# EAGLE design TOSA_Board_5 (EAGLE 9.2.0)
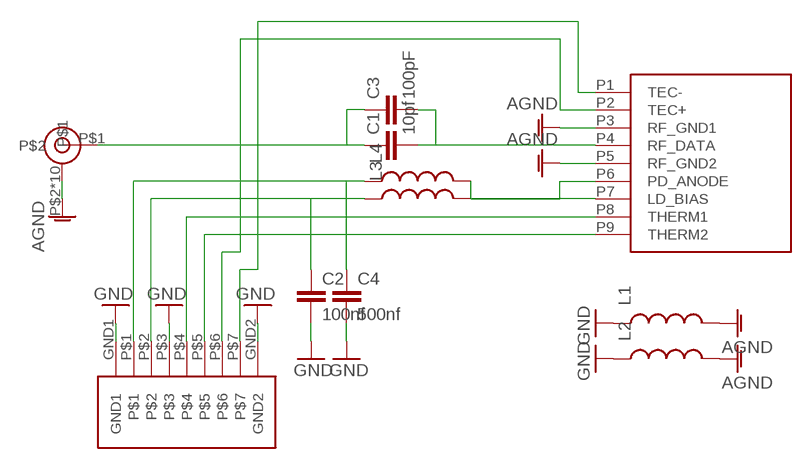
[diagram p0: schematic, sheet 1]

## Parts
C1  10pf  C-EUC0603K  [C0603K]
C2  100nf  C-EUC0603K  [C0603K]
C3  100pF  C-EUC0603K  [C0603K]
C4  500nf  C-EUC0603K  [C0603K]
L1  INDUCTOR30OHM,1.8A  [0603]
L2  INDUCTOR30OHM,1.8A  [0603]
L3  INDUCTOR30OHM,1.8A  [0603]
L4  INDUCTOR30OHM,1.8A  [0603]
U$2  TOSA  [MSA-9]
U$3  EDGE_MOUNT_MMCXMCX  [EDGE_MOUNT_MCX]
U$4  SAMTEC_T1M_X7  [SAMTEX_T1M_X7]

## Nets
AGND: L1.2 L2.2 U$2.P3(RF_GND1) U$2.P5(RF_GND2) U$3.P$2 U$3.P$3 U$3.P$4 U$3.P$5 U$3.P$6 U$3.P$7 U$3.P$8 U$3.P$9 U$3.P$10 U$3.P$11
GND: C2.2 C4.2 L1.1 L2.1 U$4.GND1 U$4.GND2 U$4.P$3
LD_BIAS: C4.1 L4.1 U$4.P$1
N$1: C1.1 C3.1 U$3.P$1
N$3: C1.2 C3.2 U$2.P4(RF_DATA)
N$6: L3.2 U$2.P6(PD_ANODE)
N$8: L4.2 U$2.P7(LD_BIAS)
PD_ANODE: C2.1 L3.1 U$4.P$2
TEC+: U$2.P2(TEC+) U$4.P$6
TEC-: U$2.P1(TEC-) U$4.P$7
THERM1: U$2.P8(THERM1) U$4.P$4
THERM2: U$2.P9(THERM2) U$4.P$5

## Library data of the parts
C1-C4 = rcl:C-EU: CAPACITOR, European symbol
L1-L4 = SparkFun-Passives:INDUCTOR: Inductors Basic Inductor/Choke - 0603 and 1206. Footprints are not proven and vary greatly between part numbers. SRN6045- 33uH, 20% 1.4A SDR0403-560KL - 56uH, 10%, 500mA RMS/740mA peak; PROD_ID: RES-07859
U$2 = custom:TOSA
U$3 = custom:EDGE_MOUNT_MMCX
U$4 = custom:SAMTEC_T1M_X7

## Board
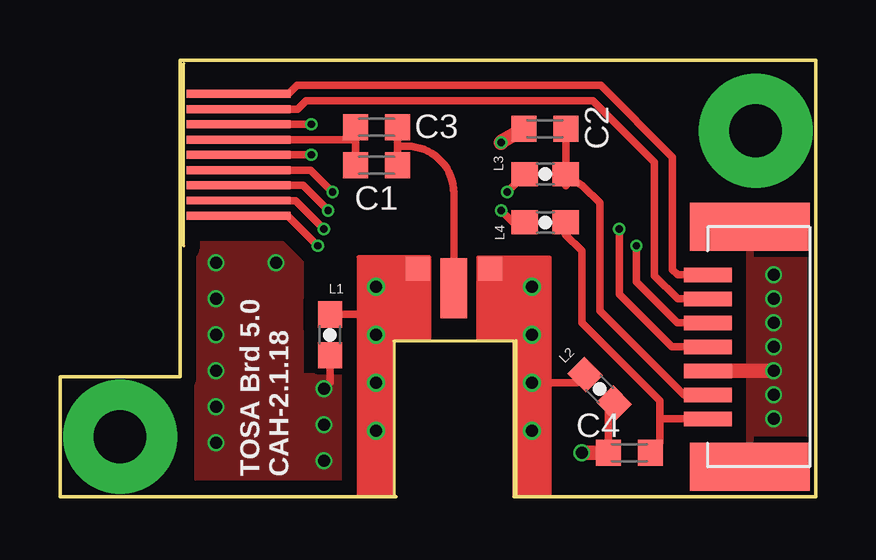
[diagram p1: board, top side]
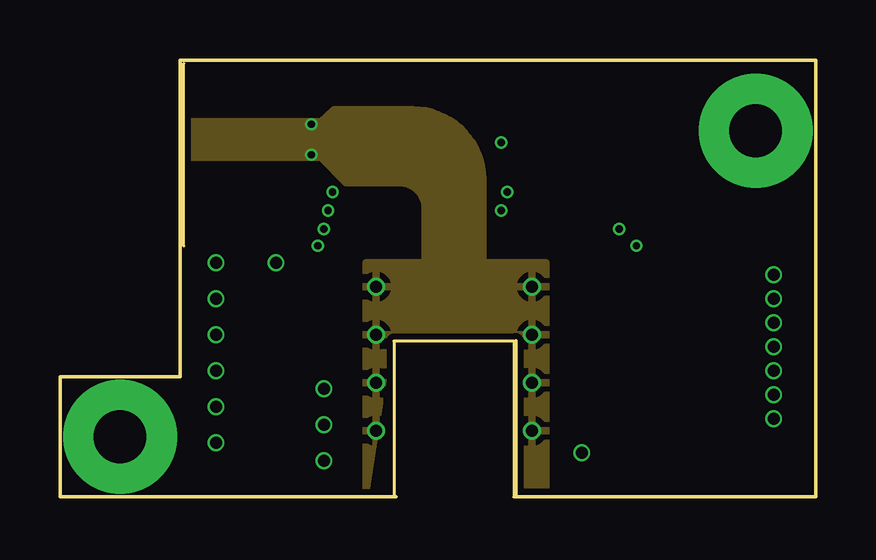
[diagram p2: board, inner layer Route2]
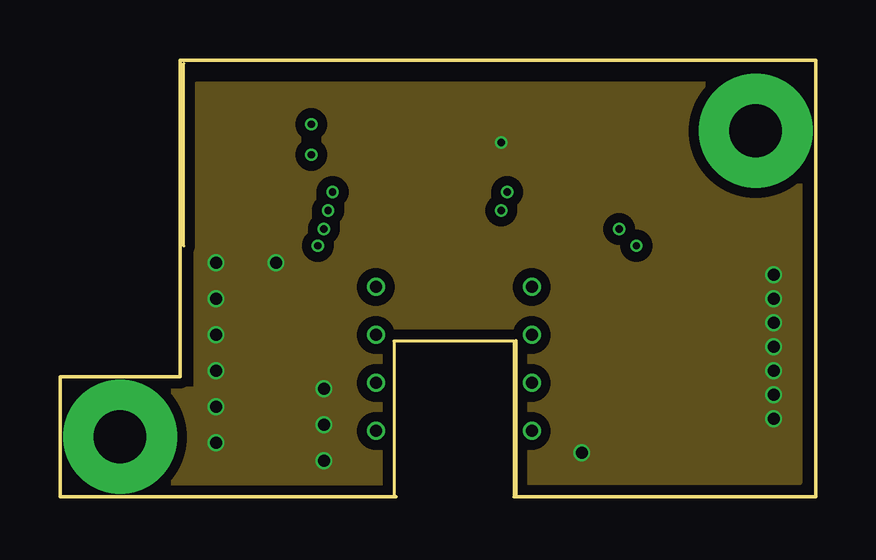
[diagram p3: board, inner layer Route15]
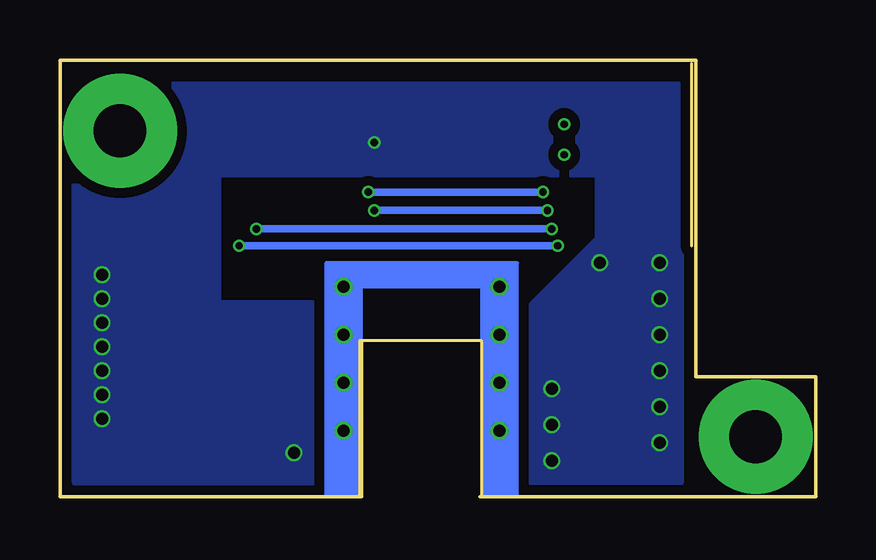
[diagram p4: board, bottom side, seen from below]

Size 31.5 x 18.2 mm. Coordinates in mm from the lower left corner, seen from the top.
Outline: 19.86,0 31.43,0
Outline: 0,0 13.24,0
Outline: 0,0 0,5 5,5 5,18.2 31.5,18.2 31.5,0 19,0 19,6.5
Outline: 0,0 14,0
Copper layers (1*2*15*16): Top 0.035559375mm / dielectric 0.17018125mm / Route2 0.01778125mm / dielectric 47mil / Route15 0.01778125mm / dielectric 0.17018125mm / Bottom 0.035559375mm
Design rules "8217": minimum track width 5mil, minimum drill 0.2mm, track to track 6mil, track to pad 6mil, pad to pad 6mil, via to via 6mil, smd to smd 0mil, copper to edge 10mil, drill to drill 12mil, minimum pad ring 4mil, minimum via ring 4mil, stop-mask expansion 2mil, vias tented up to drill 25mil, thermal gap 10mil

### Footprints (pad centres in the part's own frame; a part is rotated, then mirrored left to right if it is on the bottom)
C0603K = smd 1.05 x 1.08: 1 -0.875,0; 2 0.875,0
0603 = smd 1.1 x 1: 1 -0.85,0; 2 0.85,0
MSA-9 = smd 4.318 x 0.33: P1 0.254,-2.54; P2 0.254,-1.905; P3 0.254,-1.27; P4 0.254,-0.635; P5 0.254,0; P6 0.254,0.635; P7 0.254,1.27; P8 0.254,1.905; P9 0.254,2.54
EDGE_MOUNT_MCX = smd 2.5 x 1.1: P$1 2.2,0 | drill 0.5 pad 0.75: P$2 -3.75,3.25; P$3 -1.75,3.25; P$4 0.25,3.25; P$5 2.25,3.25; P$6 -3.75,-3.25; P$7 -1.75,-3.25; P$8 0.25,-3.25; P$9 2.25,-3.25 | smd 1 x 1: P$10 3,1.5; P$11 3,-1.5
SAMTEX_T1M_X7 = smd 2 x 5: GND1 5,1.75; GND2 -5,1.75 | smd 0.6 x 2: P$1 3,0; P$2 2,0; P$3 1,0; P$4 0,0; P$5 -1,0; P$6 -2,0; P$7 -3,0

### Placement (x,y rotation side)
C1  13.2,13.81 180 top
C2  20.22,15.33 180 top
C3  2pF  [C0603K]  13.2,15.4 180 top
C4  23.74,1.84 180 top
L1  11.25,6.75 90 top
L2  22.5,4.5 135 top
L3  20.23,13.45 180 top
L4  20.23,11.43 180 top
U$2  7.7,14.25 180 top
U$3  16.42,6.5 90 top
U$4  27,6.25 270 top

### Tracks (layer width: path | path; a pad name or v marks a point on that pad's centre or on a via)
AGND  (via drill 0.3 pad 0.51)
  Top 0.305: U$2.P3 v10.48,15.52 | U$2.P5 v10.48,14.25 | U$3.P$7 21.55,4.75 L2.2 | U$3.P$11 18.92,9.5 U$3.P$9 | U$3.P$10 13.92,9.5 U$3.P$5 | L1.2 12.65,7.6 12.75,7.5 12.75,7.17 U$3.P$4
  pour Route2: 5.4,15.62 5.4,14.15 10.89,14.15 11.93,13.09 14.27,13.09 arc-90 15.22,11.88 15.22,9.75 12.75,9.75 12.75,0.25 13.75,6.75 19,6.75 19,0.25 20.25,0.25 20.25,9.75 17.62,9.75 17.62,13.22 arc90 14.72,16.12 11.43,16.12 10.89,15.62
GND  (via drill 0.3 pad 0.51, 0.5)
  Top 0.305: C4.2 22.86,3.66 L2.1 | L1.1 11.25,4.75 v11,4.5
  Top 0.61: C4.2 v21.75,1.84 | U$4.P$3 v29.75,5.25 | C2.2 18.46,14.83 v18.39,14.76
  other vias: 29.75,9.25 29.75,8.25 29.75,7.25 29.75,6.25 29.75,4.25 29.75,3.25 9,9.75 11,3 11,1.5 6.5,6.75 6.5,8.25 6.5,9.75 6.5,5.25 6.5,3.75 6.5,2.25
  pour Route15 (isolate 0.406): 5.71,17.14 30.8,17.14 30.8,0.64 0.64,0.64 0.64,4.45 5.71,4.45
  pour Top: 26.5,12 31,12 31,0.5 26.5,0.5 26.5,2 28.75,2 28.75,10.5 26.5,10.5
  pour Top (isolate 0.61): 5.75,0.5 12.5,0.5 12.5,5 10,5 10,9.75 9.25,10.5 5.75,10.5
  pour Bottom (isolate 0.406): 30.8,17.1 5.7,17.1 5.7,0.6 11.75,0.6 11.75,8 9,10.75 9,13.5 25,13.5 25,8 21,8 21,0.6 30.8,0.6
LD_BIAS
  Top 0.305: L4.1 21.08,10.92 21.75,10.25 21.75,7.25 25,4 25,3.25 | 25,3.25 U$4.P$1 | C4.1 24.59,1.84 25,2.25 25,3.25
N$1
  Top 0.305: C3.1 14.07,14.61 | 14.07,14.61 14.47,14.61 arc-90 16.42,12.65 U$3.P$1 | C1.1 14.07,14.61
N$2  (via drill 2.2 pad 4.75)
  other vias: 2.5,2.5
N$3
  Top 0.305: C1.2 C3.2 12.32,14.88 U$2.P4
N$6  (via drill 0.3 pad 0.51)
  Top 0.305: U$2.P6 10.45,13.62 v11.36,12.7 | L3.2 19.39,13.45 v18.64,12.7
  Bottom 0.305: v11.36,12.7 v18.64,12.7
N$8  (via drill 0.3 pad 0.51)
  Top 0.305: U$2.P7 10.13,12.98 v11.18,11.93 | L4.2 18.89,11.43 v18.39,11.93
  Bottom 0.305: v11.18,11.93 v18.39,11.93
N$12  (via drill 2.2 pad 4.75)
  other vias: 29,15.25
PD_ANODE
  Top 0.305: U$4.P$2 26,4.25 22.5,7.75 22.5,12.25 21.8,12.95 L3.1 21.09,12.96 C2.1
TEC+
  Top 0.305: U$4.P$6 25.75,8.25 24.79,9.21 24.79,13.95 22.23,16.51 10.79,16.51 10.79,16.5 10.25,16.5 9.9,16.16 U$2.P2
TEC-
  Top 0.305: U$4.P$7 25.75,9.25 25.54,9.46 25.54,14.15 22.54,17.14 9.89,17.14 9.54,16.79 U$2.P1
THERM1  (via drill 0.3 pad 0.51)
  Top 0.305: v23.31,11.16 23.31,8.44 25.5,6.25 U$4.P$4 | U$2.P8 9.81,12.35 v11,11.16
  Bottom 0.305: v11,11.16 v23.31,11.16
THERM2  (via drill 0.3 pad 0.51)
  Top 0.305: U$4.P$5 25.74,7.25 24.04,8.96 v24.04,10.46 | U$2.P9 9.49,11.71 v10.75,10.46
  Bottom 0.305: v10.75,10.46 v24.04,10.46

### Text on the board
tNames: TOSA Brd 5.0 / CAH-2.1.18